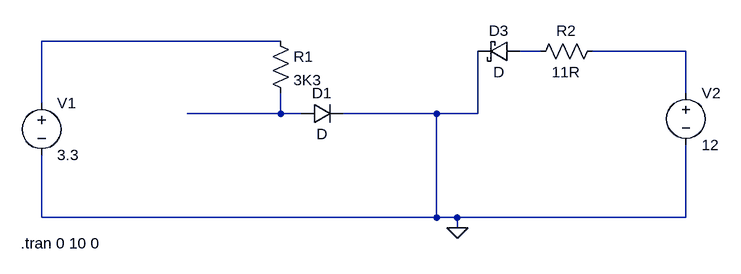
[diagram p0: schematic Draft2.asc]
Draft2.asc, the LTspice schematic file:
Version 4
SHEET 1 880 680
WIRE 128 64 -240 64
WIRE 528 80 496 80
WIRE 752 80 608 80
WIRE 752 144 752 80
WIRE -240 160 -240 64
WIRE 128 176 128 144
WIRE 128 176 -16 176
WIRE 160 176 128 176
WIRE 368 176 224 176
WIRE 432 176 432 80
WIRE 432 176 368 176
WIRE -240 336 -240 240
WIRE 368 336 368 176
WIRE 368 336 -240 336
WIRE 400 336 368 336
WIRE 752 336 752 224
WIRE 752 336 400 336
WIRE 400 352 400 336
FLAG 400 352 0
SYMBOL res 112 48 R0
SYMATTR InstName R1
SYMATTR Value 3K3
SYMBOL voltage -240 144 R0
WINDOW 123 0 0 Left 0
WINDOW 39 0 0 Left 0
SYMATTR InstName V1
SYMATTR Value 3.3
SYMBOL voltage 752 128 R0
WINDOW 123 0 0 Left 0
WINDOW 39 0 0 Left 0
SYMATTR InstName V2
SYMATTR Value 12
SYMBOL diode 160 192 R270
WINDOW 0 32 32 VTop 2
WINDOW 3 0 32 VBottom 2
SYMATTR InstName D1
SYMBOL res 624 64 R90
WINDOW 0 0 56 VBottom 2
WINDOW 3 32 56 VTop 2
SYMATTR InstName R2
SYMATTR Value 11R
SYMBOL schottky 496 64 R90
WINDOW 0 0 32 VBottom 2
WINDOW 3 32 32 VTop 2
SYMATTR InstName D3
TEXT -272 376 Left 2 !.tran 0 10 0

The netlist it stands for:
* Draft2.asc
R1 N001 N004 3K3
V1 N001 0 3.3
V2 N003 0 12
D1 N004 0 D
R2 N003 N002 11R
D3 N002 0 D
.model D D
.lib standard.dio
.tran 0 10 0
.backanno
.end